# EAGLE design R121A (EAGLE 6.6.0)
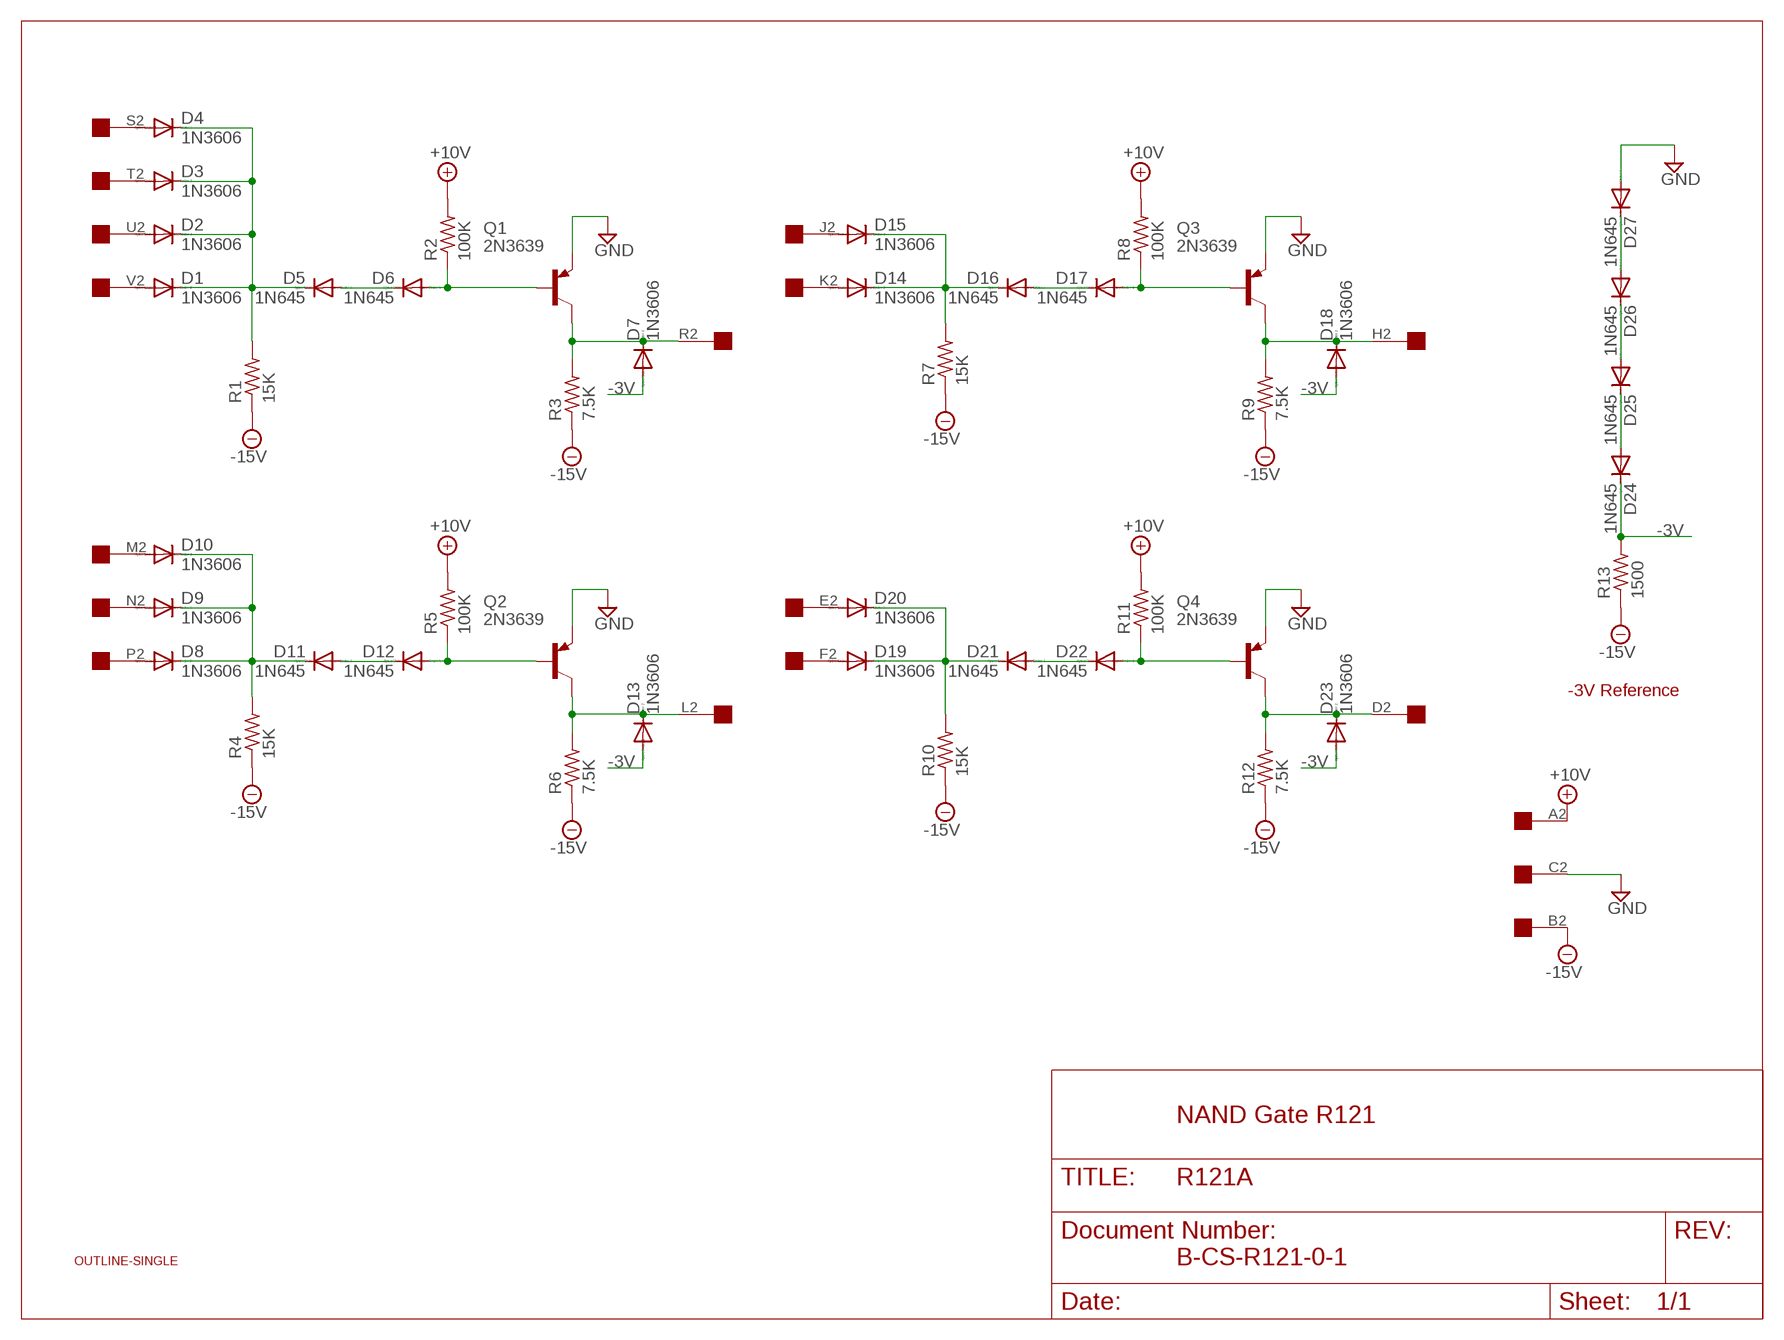
[diagram p0: schematic, sheet 1]

## Parts
D1  1N3606  1N4148DO35-10  [DO35-10]
D2  1N3606  1N4148DO35-10  [DO35-10]
D3  1N3606  1N4148DO35-10  [DO35-10]
D4  1N3606  1N4148DO35-10  [DO35-10]
D5  1N645  1N4148DO35-10  [DO35-10]
D6  1N645  1N4148DO35-10  [DO35-10]
D7  1N3606  1N4148DO35-10  [DO35-10]
D8  1N3606  1N4148DO35-10  [DO35-10]
D9  1N3606  1N4148DO35-10  [DO35-10]
D10  1N3606  1N4148DO35-10  [DO35-10]
D11  1N645  1N4148DO35-10  [DO35-10]
D12  1N645  1N4148DO35-10  [DO35-10]
D13  1N3606  1N4148DO35-10  [DO35-10]
D14  1N3606  1N4148DO35-10  [DO35-10]
D15  1N3606  1N4148DO35-10  [DO35-10]
D16  1N645  1N4148DO35-10  [DO35-10]
D17  1N645  1N4148DO35-10  [DO35-10]
D18  1N3606  1N4148DO35-10  [DO35-10]
D19  1N3606  1N4148DO35-10  [DO35-10]
D20  1N3606  1N4148DO35-10  [DO35-10]
D21  1N645  1N4148DO35-10  [DO35-10]
D22  1N645  1N4148DO35-10  [DO35-10]
D23  1N3606  1N4148DO35-10  [DO35-10]
D24  1N645  1N4148DO35-10  [DO35-10]
D25  1N645  1N4148DO35-10  [DO35-10]
D26  1N645  1N4148DO35-10  [DO35-10]
D27  1N645  1N4148DO35-10  [DO35-10]
Q1  2N3639  2N3637  [TO39]
Q2  2N3639  2N3637  [TO39]
Q3  2N3639  2N3637  [TO39]
Q4  2N3639  2N3637  [TO39]
R1  15K  R-US_0207/10  [0207/10]
R2  100K  R-US_0207/10  [0207/10]
R3  7.5K  R-US_0207/10  [0207/10]
R4  15K  R-US_0207/10  [0207/10]
R5  100K  R-US_0207/10  [0207/10]
R6  7.5K  R-US_0207/10  [0207/10]
R7  15K  R-US_0207/10  [0207/10]
R8  100K  R-US_0207/10  [0207/10]
R9  7.5K  R-US_0207/10  [0207/10]
R10  15K  R-US_0207/10  [0207/10]
R11  100K  R-US_0207/10  [0207/10]
R12  7.5K  R-US_0207/10  [0207/10]
R13  1500  R-US_0207/10  [0207/10]
U$1  OUTLINE-SINGLE  [SINGLE]
U$2  EDGE-1  [EDGE-CON1]

## Nets
+10V [Power]: R2.2 R5.2 R8.2 R11.2 U$2.A2
-3V [Power]: D7.A D13.A D18.A D23.A D24.C R13.2
-15V [Power]: R1.1 R3.1 R4.1 R6.1 R7.1 R9.1 R10.1 R12.1 R13.1 U$2.B2
GND [Power]: D27.A Q1.1(E) Q2.1(E) Q3.1(E) Q4.1(E) U$2.C2
N$1: D8.A U$2.P2
N$2: D12.A Q2.2(B) R5.1
N$3: D26.A D27.C
N$4: D13.C Q2.3(C) R6.2 U$2.L2
N$5: D7.C Q1.3(C) R3.2 U$2.R2
N$6: D8.C D9.C D10.C D11.C R4.2
N$7: D11.A D12.C
N$8: D17.A Q3.2(B) R8.1
N$9: D18.C Q3.3(C) R9.2 U$2.H2
N$10: D14.A U$2.K2
N$11: D14.C D15.C D16.C R7.2
N$12: D16.A D17.C
N$13: D25.A D26.C
N$14: D9.A U$2.N2
N$15: D20.A U$2.E2
N$16: D24.A D25.C
N$17: D19.A U$2.F2
N$18: D22.A Q4.2(B) R11.1
N$19: D6.A Q1.2(B) R2.1
N$20: D4.A U$2.S2
N$21: D1.A U$2.V2
N$22: D1.C D2.C D3.C D4.C D5.C R1.2
N$23: D5.A D6.C
N$24: D23.C Q4.3(C) R12.2 U$2.D2
N$25: D3.A U$2.T2
N$26: D19.C D20.C D21.C R10.2
N$27: D21.A D22.C
N$28: D10.A U$2.M2
N$31: D15.A U$2.J2
N$39: D2.A U$2.U2

## Notes on the sheet
- -3V Reference
- NAND Gate R121
- B-CS-R121-0-1

## Library data of the parts
D1-D27 = diode:1N4148: DIODE high speed (Philips)
Q1-Q4 = transistor-pnp:2N3637*: PNP Transistror
R1-R13 = rcl:R-US_: RESISTOR, American symbol
U$1 = dec-con:OUTLINE-*: Board outlines for DEC boards.
U$2 = dec-con:EDGE-1: Single-Sided DEC Edge Connector -- (side 2)

## Net classes
1 Power: width 0.813 mm

## Board
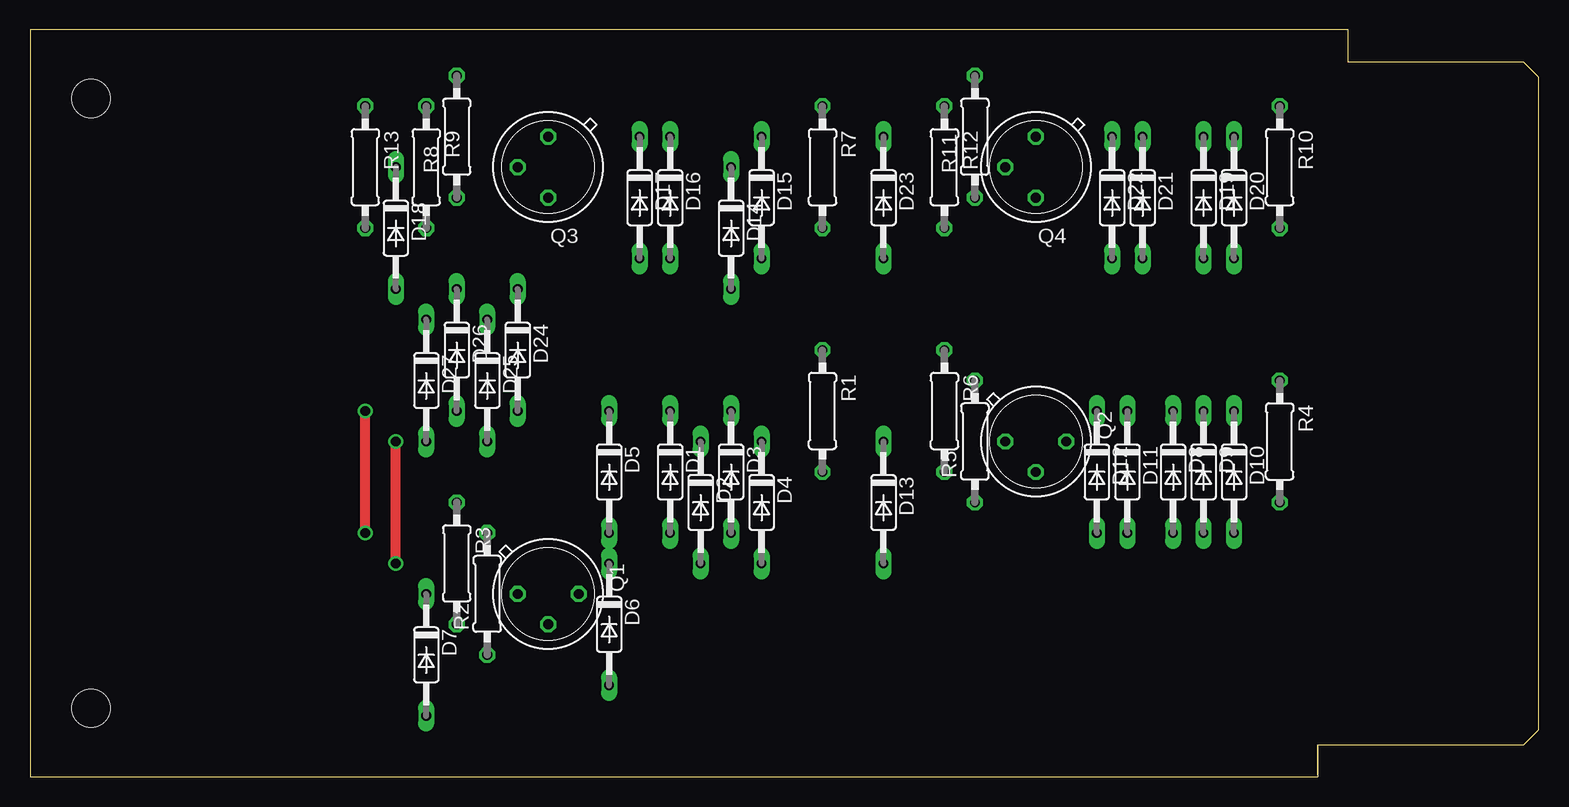
[diagram p1: board, top side]
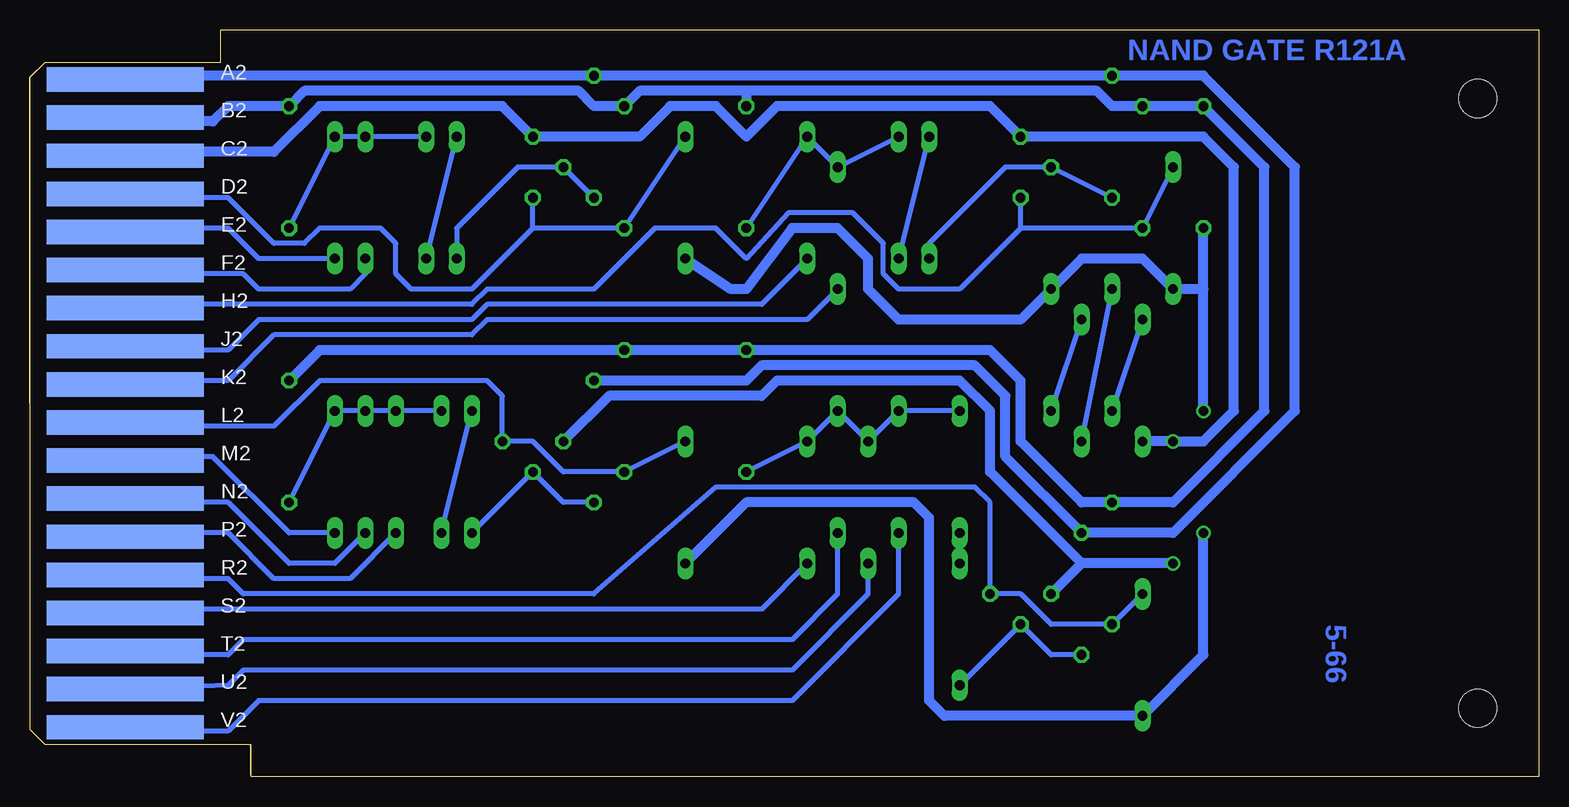
[diagram p2: board, bottom side, seen from below]

Size 125.73 x 62.23 mm. Coordinates in mm from the lower left corner, seen from the top.
Copper layers (1+16): Top 0.035mm / dielectric 1.5mm / Bottom 0.035mm
Design rules "16mils": minimum track width 16mil, minimum drill 32mil, track to track 15mil, track to pad 10mil, pad to pad 10mil, via to via 10mil, smd to smd 10mil, copper to edge 13mil, drill to drill 10mil, minimum pad ring 10mil, minimum via ring 8mil, stop-mask expansion 0mil, vias tented up to drill 0mil, thermal gap 10mil

### Footprints (pad centres in the part's own frame; a part is rotated, then mirrored left to right if it is on the bottom)
DO35-10 = drill 0.813 long: A 5.08,0; C -5.08,0
TO39 = drill 0.813 octagon: 1 0,-2.54; 2 2.54,0; 3 0,2.54
0207/10 = drill 0.813 octagon: 1 -5.08,0; 2 5.08,0
SINGLE = hole 3.175: 120.65,56.515; 120.65,5.715
EDGE-CON1 = smd 13.106 x 2.032 bottom: A2 7.938,4.128; B2 7.938,7.303; C2 7.938,10.477; D2 7.938,13.652; E2 7.938,16.828; F2 7.938,20.003; H2 7.938,23.177; J2 7.938,26.352; K2 7.938,29.527; L2 7.938,32.703; M2 7.938,35.877; N2 7.938,39.053; P2 7.938,42.227; R2 7.938,45.403; S2 7.938,48.578; T2 7.938,51.752; U2 7.938,54.928; V2 7.938,58.102

### Placement (x,y rotation side)
D1  53.34,25.4 270 top
D2  55.88,22.86 270 top
D3  58.42,25.4 270 top
D4  60.96,22.86 270 top
D5  48.26,25.4 270 top
D6  48.26,12.7 270 top
D7  33.02,10.16 270 top
D8  95.25,25.4 270 top
D9  97.79,25.4 270 top
D10  100.33,25.4 270 top
D11  91.44,25.4 270 top
D12  88.9,25.4 270 top
D13  71.12,22.86 270 top
D14  58.42,45.72 270 top
D15  60.96,48.26 270 top
D16  53.34,48.26 270 top
D17  50.8,48.26 270 top
D18  30.48,45.72 270 top
D19  97.79,48.26 270 top
D20  100.33,48.26 270 top
D21  92.71,48.26 270 top
D22  90.17,48.26 270 top
D23  71.12,48.26 270 top
D24  40.64,35.56 270 top
D25  38.1,33.02 270 top
D26  35.56,35.56 270 top
D27  33.02,33.02 270 top
Q1  43.18,15.24 270 top
Q2  83.82,27.94 270 top
Q3  43.18,50.8 180 top
Q4  83.82,50.8 180 top
R1  66.04,30.48 270 top
R2  38.1,15.24 90 top
R3  35.56,17.78 270 top
R4  104.14,27.94 270 top
R5  78.74,27.94 90 top
R6  76.2,30.48 270 top
R7  66.04,50.8 270 top
R8  35.56,53.34 90 top
R9  33.02,50.8 270 top
R10  104.14,50.8 270 top
R11  78.74,53.34 90 top
R12  76.2,50.8 270 top
R13  27.94,50.8 270 top
U$1  125.73,62.23 180 top
U$2  125.73,62.23 180 top

### Tracks (layer width: path | path; a pad name or v marks a point on that pad's centre or on a via)
+10V
  Bottom 0.813: U$2.A2 116.84,58.42 R11.2 R8.2 27.94,58.42 20.32,50.8 20.32,30.48 30.48,20.32 R2.2 44.45,26.67 44.45,31.75 46.99,34.29 64.77,34.29 66.04,33.02 R5.2
-3V  (via drill 0.81)
  Top 0.813: v27.94,20.32 v27.94,30.48
  Bottom 0.813: 27.94,40.64 R13.2 | v27.94,20.32 27.94,10.16 D7.A 49.53,5.08 50.8,6.35 50.8,21.59 52.07,22.86 66.04,22.86 D13.A | v27.94,30.48 27.94,40.64 | 27.94,40.64 D18.A 33.02,43.18 38.1,43.18 D24.C 43.18,38.1 53.34,38.1 55.88,40.64 55.88,43.18 58.42,45.72 62.23,45.72 66.04,40.64 67.31,40.64 D23.A
-15V
  Bottom 0.813: U$2.B2 116.84,54.61 110.49,54.61 109.22,55.88 R10.1 102.87,57.15 80.01,57.15 78.74,55.88 R12.1 74.93,57.15 66.04,57.15 | 66.04,57.15 36.83,57.15 35.56,55.88 R9.1 R13.1 22.86,50.8 22.86,30.48 30.48,22.86 R3.1 38.1,22.86 43.18,27.94 43.18,33.02 45.72,35.56 R1.1 R6.1 101.6,35.56 R4.1 | 66.04,57.15 R7.1
GND  (via drill 0.81)
  Top 0.813: v30.48,17.78 v30.48,27.94
  Bottom 0.813: U$2.C2 116.84,52.07 105.41,52.07 101.6,55.88 86.36,55.88 Q4.1 74.93,53.34 72.39,55.88 68.58,55.88 66.04,53.34 63.5,55.88 45.72,55.88 Q3.1 27.94,53.34 25.4,50.8 25.4,30.48 27.94,27.94 v30.48,27.94 D27.A | v30.48,17.78 38.1,17.78 | 38.1,17.78 Q1.1 | Q2.1 77.47,31.75 64.77,31.75 63.5,33.02 48.26,33.02 45.72,30.48 45.72,25.4 38.1,17.78
N$1
  Bottom 0.406: D8.A 99.06,16.51 105.41,16.51 109.22,20.32 116.84,20.32 U$2.P2
N$2
  Bottom 0.406: R5.1 81.28,22.86 Q2.2 D12.A
N$3
  Bottom 0.406: D26.A D27.C
N$4
  Bottom 0.406: U$2.L2 111.76,29.21 105.41,29.21 101.6,33.02 87.63,33.02 86.36,31.75 Q2.3 83.82,27.94 81.28,25.4 R6.2 D13.C
N$5
  Bottom 0.406: D7.C R3.2 40.64,12.7 43.18,15.24 Q1.3 45.72,22.86 46.99,24.13 68.58,24.13 78.74,15.24 107.95,15.24 109.22,16.51 111.76,16.51 U$2.R2
N$6
  Bottom 0.406: D11.C D8.C D9.C D10.C R4.2
N$7
  Bottom 0.406: D11.A D12.C
N$8
  Bottom 0.406: R8.1 Q3.2 44.45,50.8 50.8,44.45 D17.A
N$9
  Bottom 0.406: U$2.H2 116.84,39.37 88.9,39.37 87.63,40.64 78.74,40.64 73.66,45.72 68.58,45.72 66.04,43.18 62.55,46.99 57.15,46.99 54.61,44.45 54.61,41.91 53.34,40.64 48.26,40.64 43.18,45.72 | D18.C R9.2 43.18,45.72 | 43.18,45.72 Q3.3
N$10
  Bottom 0.406: D14.A 60.96,38.1 87.63,38.1 88.9,36.83 105.41,36.83 109.22,33.02 116.84,33.02 U$2.K2
N$11
  Bottom 0.406: D16.C D14.C D15.C R7.2
N$12
  Bottom 0.406: D16.A D17.C
N$13
  Bottom 0.406: D25.A D26.C
N$14
  Bottom 0.406: D9.A 100.33,17.78 104.14,17.78 109.22,22.86 116.84,22.86 U$2.N2
N$15
  Bottom 0.406: U$2.E2 116.84,45.72 109.22,45.72 106.68,43.18 D20.A
N$16
  Bottom 0.406: D24.A D25.C
N$17
  Bottom 0.406: D19.A 97.79,41.91 99.06,40.64 106.68,40.64 107.95,41.91 116.84,41.91 U$2.F2
N$18
  Bottom 0.406: R11.1 Q4.2 85.09,50.8 90.17,45.72 D22.A
N$19
  Bottom 0.406: D6.A Q1.2 40.64,10.16 R2.1
N$20
  Bottom 0.406: U$2.S2 116.84,13.97 64.77,13.97 D4.A
N$21
  Bottom 0.406: D1.A 53.34,15.24 62.23,6.35 106.68,6.35 109.22,3.81 116.84,3.81 U$2.V2
N$22
  Bottom 0.406: D5.C D1.C D2.C D3.C D4.C R1.2
N$23
  Bottom 0.406: D6.C D5.A
N$24
  Bottom 0.406: U$2.D2 116.84,48.26 109.22,48.26 105.41,44.45 102.87,44.45 101.6,45.72 96.52,45.72 95.25,44.45 95.25,41.91 93.98,40.64 88.9,40.64 83.82,45.72 | 83.82,45.72 Q4.3 | 83.82,45.72 R12.2 D23.C
N$25
  Bottom 0.406: U$2.T2 116.84,10.16 109.22,10.16 107.95,11.43 62.23,11.43 58.42,15.24 D3.A
N$26
  Bottom 0.406: D21.C D19.C D20.C R10.2
N$27
  Bottom 0.406: D21.A D22.C
N$28
  Bottom 0.406: U$2.M2 116.84,26.67 110.49,26.67 104.14,20.32 D10.A
N$31
  Bottom 0.406: U$2.J2 116.84,35.56 109.22,35.56 106.68,38.1 88.9,38.1 87.63,39.37 64.77,39.37 D15.A
N$39
  Bottom 0.406: U$2.U2 109.22,7.62 107.95,8.89 62.23,8.89 55.88,15.24 D2.A

### Text on the board
Bottom: NAND GATE R121A | 5-66